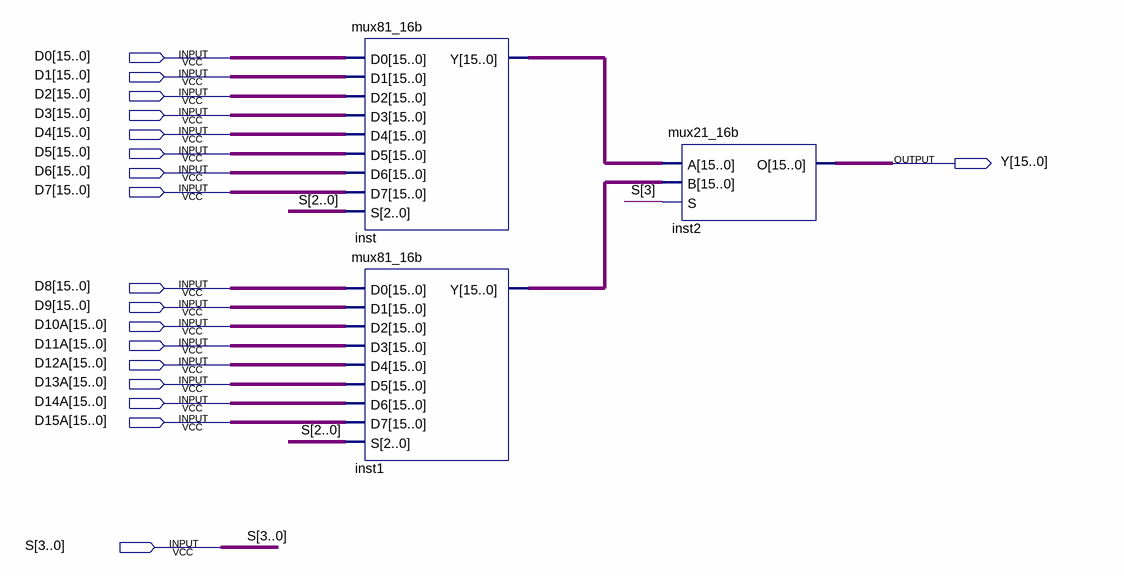
[diagram p0: schematic sheet]
// Quartus schematic mux161_16b.bdf as structural Verilog: 3 symbols, 18 pins
module mux161_16b (
  input  [15:0] D0,
  input  [15:0] D1,
  input  [15:0] D2,
  input  [15:0] D3,
  input  [15:0] D4,
  input  [15:0] D5,
  input  [15:0] D6,
  input  [15:0] D7,
  input  [15:0] D8,
  input  [15:0] D9,
  input  [15:0] D10A,
  input  [15:0] D11A,
  input  [15:0] D12A,
  input  [15:0] D13A,
  input  [15:0] D14A,
  input  [15:0] D15A,
  input  [3:0] S,
  output [15:0] Y
);

  wire [15:0] inst1_y, inst_y;

  mux81_16b inst (.D0(D0), .D1(D1), .D2(D2), .D3(D3), .D4(D4), .D5(D5), .D6(D6), .D7(D7), .S(S[2:0]), .Y(inst_y));
  mux81_16b inst1 (
    .D0(D8), .D1(D9), .D2(D10A), .D3(D11A), .D4(D12A), .D5(D13A), .D6(D14A), .D7(D15A), .S(S[2:0]),
    .Y(inst1_y));
  mux21_16b inst2 (.A(inst_y), .B(inst1_y), .S(S[3]), .O(Y));
endmodule
